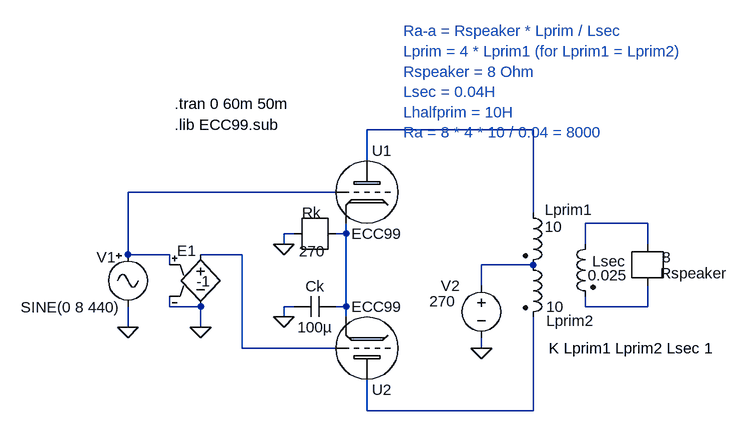
[diagram p0: schematic ECC99-amp.asc]
ECC99-amp.asc, the LTspice schematic file:
Version 4
SHEET 1 1060 680
WIRE 752 160 496 160
WIRE 496 208 496 160
WIRE 448 256 128 256
WIRE 752 288 752 160
WIRE 928 304 832 304
WIRE 384 320 368 320
WIRE 464 320 464 304
WIRE 464 320 448 320
WIRE 368 336 368 320
WIRE 832 336 832 304
WIRE 928 336 928 304
WIRE 128 352 128 256
WIRE 192 352 128 352
WIRE 304 352 240 352
WIRE 192 368 192 352
WIRE 752 368 672 368
WIRE 672 400 672 368
WIRE 192 432 192 416
WIRE 240 432 192 432
WIRE 384 432 368 432
WIRE 464 432 464 320
WIRE 464 432 448 432
WIRE 832 432 832 416
WIRE 928 432 928 400
WIRE 928 432 832 432
WIRE 368 448 368 432
WIRE 464 448 464 432
WIRE 128 464 128 432
WIRE 240 464 240 432
WIRE 304 496 304 352
WIRE 448 496 304 496
WIRE 672 496 672 480
WIRE 496 592 496 544
WIRE 752 592 752 448
WIRE 752 592 496 592
FLAG 672 496 0
FLAG 128 464 0
FLAG 240 464 0
FLAG 368 336 0
FLAG 368 448 0
SYMBOL voltage 672 384 R0
WINDOW 0 -62 16 Left 2
WINDOW 3 -80 40 Left 2
SYMATTR InstName V2
SYMATTR Value 270
SYMBOL ECC99 496 256 R0
SYMATTR InstName U1
SYMBOL signal 128 336 R0
WINDOW 0 -48 20 Left 2
WINDOW 3 -165 97 Left 2
SYMATTR InstName V1
SYMATTR Value SINE(0 8 440)
SYMBOL ECC99 496 496 M180
SYMATTR InstName U2
SYMBOL ind2 736 272 R0
WINDOW 0 34 11 Left 2
WINDOW 3 34 37 Left 2
SYMATTR InstName Lprim1
SYMATTR Value 10
SYMBOL ind2 736 352 R0
WINDOW 0 36 102 Left 2
SYMATTR InstName Lprim2
SYMATTR Value 10
SYMBOL ind2 848 320 M0
WINDOW 0 -46 42 Left 2
WINDOW 3 -49 64 Left 2
SYMATTR InstName Lsec
SYMATTR Value 0.025
SYMBOL r 928 336 R90
WINDOW 0 45 -123 VRight 2
WINDOW 3 20 -36 VRight 2
SYMATTR InstName Rspeaker
SYMATTR Value 8
SYMBOL e 240 336 R0
WINDOW 0 -36 10 Left 2
WINDOW 3 -6 57 Left 2
SYMATTR InstName E1
SYMATTR Value -1
SYMBOL r 384 320 R0
WINDOW 0 41 -32 Right 2
WINDOW 3 48 27 Right 2
SYMATTR InstName Rk
SYMATTR Value 270
SYMBOL cap 448 416 R90
WINDOW 0 0 32 VBottom 2
WINDOW 3 32 32 VTop 2
SYMATTR InstName Ck
SYMATTR Value 100µ
TEXT 200 152 Left 2 !.lib ECC99.sub
TEXT 776 496 Left 2 !K Lprim1 Lprim2 Lsec 1
TEXT 552 8 Left 2 ;Ra-a = Rspeaker * Lprim / Lsec\nLprim = 4 * Lprim1 (for Lprim1 = Lprim2)\nRspeaker = 8 Ohm\nLsec = 0.04H\nLhalfprim = 10H\nRa = 8 * 4 * 10 / 0.04 = 8000
TEXT 200 120 Left 2 !.tran 0 60m 50m

The netlist it stands for:
* ECC99-amp.asc
V2 N006 0 270
XU1 N001 N002 N004 ECC99  ; pins Plate Grid Cathode
V1 N002 0 SINE(0 8 440)
XU2 N008 N005 N004 ECC99  ; pins Plate Grid Cathode
Lprim1 N001 N006 10
Lprim2 N006 N008 10
Lsec N003 N007 0.025
Rspeaker N007 N003 8
E1 N005 0 N002 0 -1
Rk N004 0 270
Ck N004 0 100µ
.lib ECC99.sub
K Lprim1 Lprim2 Lsec 1
* Ra-a = Rspeaker * Lprim / Lsec
* Lprim = 4 * Lprim1 (for Lprim1 = Lprim2)
* Rspeaker = 8 Ohm
* Lsec = 0.04H
* Lhalfprim = 10H
* Ra = 8 * 4 * 10 / 0.04 = 8000
.tran 0 60m 50m
.lib ECC99.sub
.backanno
.end